# EAGLE design InputModule2 (EAGLE 6.3)
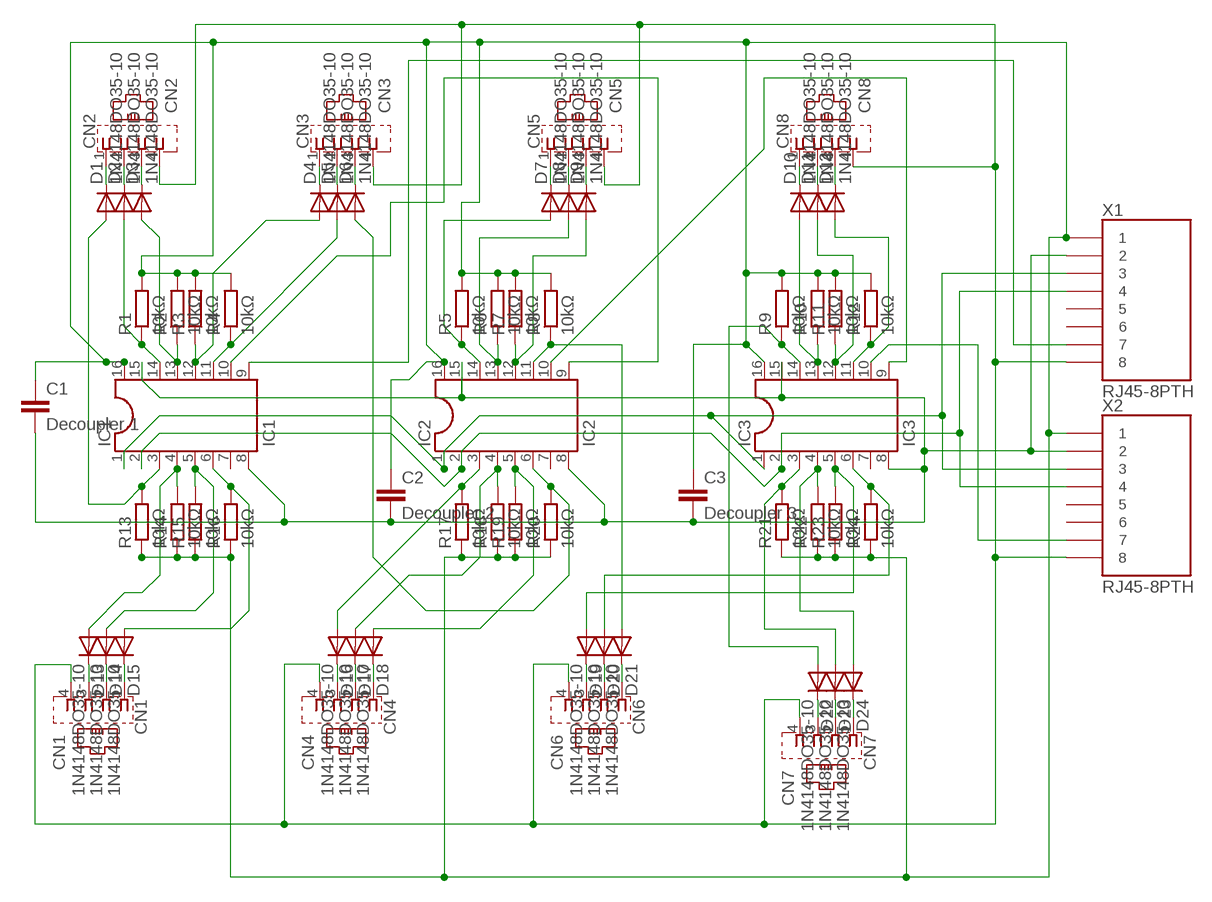
[diagram p0: schematic, sheet 1]

## Parts
C1  Decoupler 1  C5/2.5  [C5B2.5]
C2  Decoupler 2  C5/2.5  [C5B2.5]
C3  Decoupler 3  C5/2.5  [C5B2.5]
CN1  CN1  RJ11-6PC4  [RJ116PC4]
CN2  CN2  RJ11-6PC4  [RJ116PC4]
CN3  CN3  RJ11-6PC4  [RJ116PC4]
CN4  CN4  RJ11-6PC4  [RJ116PC4]
CN5  CN5  RJ11-6PC4  [RJ116PC4]
CN6  CN6  RJ11-6PC4  [RJ116PC4]
CN7  CN7  RJ11-6PC4  [RJ116PC4]
CN8  CN8  RJ11-6PC4  [RJ116PC4]
D1  1N4148DO35-10  [DO35-10]
D2  1N4148DO35-10  [DO35-10]
D3  1N4148DO35-10  [DO35-10]
D4  1N4148DO35-10  [DO35-10]
D5  1N4148DO35-10  [DO35-10]
D6  1N4148DO35-10  [DO35-10]
D7  1N4148DO35-10  [DO35-10]
D8  1N4148DO35-10  [DO35-10]
D9  1N4148DO35-10  [DO35-10]
D10  1N4148DO35-10  [DO35-10]
D11  1N4148DO35-10  [DO35-10]
D12  1N4148DO35-10  [DO35-10]
D13  1N4148DO35-10  [DO35-10]
D14  1N4148DO35-10  [DO35-10]
D15  1N4148DO35-10  [DO35-10]
D16  1N4148DO35-10  [DO35-10]
D17  1N4148DO35-10  [DO35-10]
D18  1N4148DO35-10  [DO35-10]
D19  1N4148DO35-10  [DO35-10]
D20  1N4148DO35-10  [DO35-10]
D21  1N4148DO35-10  [DO35-10]
D22  1N4148DO35-10  [DO35-10]
D23  1N4148DO35-10  [DO35-10]
D24  1N4148DO35-10  [DO35-10]
IC1  IC1  DIL16S  [SOCKET-16]
IC2  IC2  DIL16S  [SOCKET-16]
IC3  IC3  DIL16S  [SOCKET-16]
R1  10kΩ  R-EU_0207/10  [0207/10]
R2  10kΩ  R-EU_0207/10  [0207/10]
R3  10kΩ  R-EU_0207/10  [0207/10]
R4  10kΩ  R-EU_0207/10  [0207/10]
R5  10kΩ  R-EU_0207/10  [0207/10]
R6  10kΩ  R-EU_0207/10  [0207/10]
R7  10kΩ  R-EU_0207/10  [0207/10]
R8  10kΩ  R-EU_0207/10  [0207/10]
R9  10kΩ  R-EU_0207/10  [0207/10]
R10  10kΩ  R-EU_0207/10  [0207/10]
R11  10kΩ  R-EU_0207/10  [0207/10]
R12  10kΩ  R-EU_0207/10  [0207/10]
R13  10kΩ  R-EU_0207/10  [0207/10]
R14  10kΩ  R-EU_0207/10  [0207/10]
R15  10kΩ  R-EU_0207/10  [0207/10]
R16  10kΩ  R-EU_0207/10  [0207/10]
R17  10kΩ  R-EU_0207/10  [0207/10]
R18  10kΩ  R-EU_0207/10  [0207/10]
R19  10kΩ  R-EU_0207/10  [0207/10]
R20  10kΩ  R-EU_0207/10  [0207/10]
R21  10kΩ  R-EU_0207/10  [0207/10]
R22  10kΩ  R-EU_0207/10  [0207/10]
R23  10kΩ  R-EU_0207/10  [0207/10]
R24  10kΩ  R-EU_0207/10  [0207/10]
X1  RJ45-8PTH  [RJ45-8]
X2  RJ45-8PTH  [RJ45-8]

## Nets
3RD_DEBUG: CN1.4 CN2.4 CN3.4 CN4.4 CN5.4 CN6.4 CN7.4 CN8.4 X1.8 X2.8
GND: C1.2 C2.2 C3.2 IC1.8 IC1.15 IC2.8 IC2.15 IC3.8 IC3.15 X1.2 X2.2
N$1: CN8.2 D11.C
N$2: CN5.2 D8.C
N$3: CN8.1 D10.C
N$4: CN8.3 D12.C
N$5: CN7.1 D24.C
N$6: CN2.2 D2.C
N$7: CN3.1 D4.C
N$8: CN7.2 D23.C
N$9: CN1.3 D13.C
N$10: CN6.2 D20.C
N$11: CN7.3 D22.C
N$12: CN6.1 D21.C
N$13: CN2.1 D1.C
N$14: CN2.3 D3.C
N$15: CN3.2 D5.C
N$16: CN3.3 D6.C
N$17: CN5.1 D7.C
N$18: CN5.3 D9.C
N$19: CN6.3 D19.C
N$20: CN4.2 D17.C
N$21: CN4.1 D18.C
N$22: CN4.3 D16.C
N$23: CN1.2 D14.C
N$24: CN1.1 D15.C
N$25: D13.A IC1.4 R14.2
N$26: D1.A IC1.3 R13.2
N$27: D14.A IC1.5 R15.2
N$28: D12.A IC3.11 R12.1
N$29: D24.A IC3.4 R22.2
N$30: D20.A IC3.6 R24.2
N$31: D2.A IC1.14 R1.1
N$32: D3.A IC1.13 R2.1
N$33: D4.A IC1.12 R3.1
N$34: D5.A IC1.11 R4.1
N$35: D7.A IC2.14 R5.1
N$36: D8.A IC2.13 R6.1
N$37: D9.A IC2.12 R7.1
N$38: D21.A IC2.11 R8.1
N$39: D15.A IC1.6 R16.2
N$40: D10.A IC3.13 R10.1
N$41: D17.A IC2.4 R18.2
N$42: D16.A IC2.3 R17.2
N$43: D18.A IC2.5 R19.2
N$44: D6.A IC2.6 R20.2
N$45: D19.A IC3.5 R23.2
N$46: D23.A IC3.3 R21.2
N$47: D11.A IC3.12 R11.1
N$48: D22.A IC3.14 R9.1
N$50: IC1.1 IC2.1 IC3.1 X1.3 X2.3
N$52: IC1.2 IC2.2 IC3.2 X1.4 X2.4
N$56: IC1.10 IC2.9
N$57: IC2.10 IC3.9
N$58: IC1.9 X1.7
N$60: IC3.10 X2.7
VCC: C1.1 C2.1 C3.1 IC1.16 IC2.16 IC3.16 R1.2 R2.2 R3.2 R4.2 R5.2 R6.2 R7.2 R8.2 R9.2 R10.2 R11.2 R12.2 R13.1 R14.1 R15.1 R16.1 R17.1 R18.1 R19.1 R20.1 R21.1 R22.1 R23.1 R24.1 X1.1 X2.1
Unconnected: IC1.7 IC2.7 IC3.7 X1.5 X1.6 X2.5 X2.6

## Library data of the parts
C1-C3 = capacitor-wima:C: CAPACITOR naming: grid - package width
CN1-CN8 = RailLibrary:RJ11-6PC4
D1-D24 = diode:1N4148: DIODE high speed (Philips)
IC1-IC3 = ic-package:DIL16: Dual In Line / Socket
R1-R24 = resistor:R-EU_: RESISTOR, European symbol
X1 X2 = SparkFun-Connectors:RJ45-8: RJ45 Jack Simple RJ45, 8-pin connection - connector for common Cat5, Cat5e, and Cat6 Ethernet cables. Footprint not yet proven in production. Connector sku is PRT-00643; Breakout PCB sku is BOB-00716.

## Board
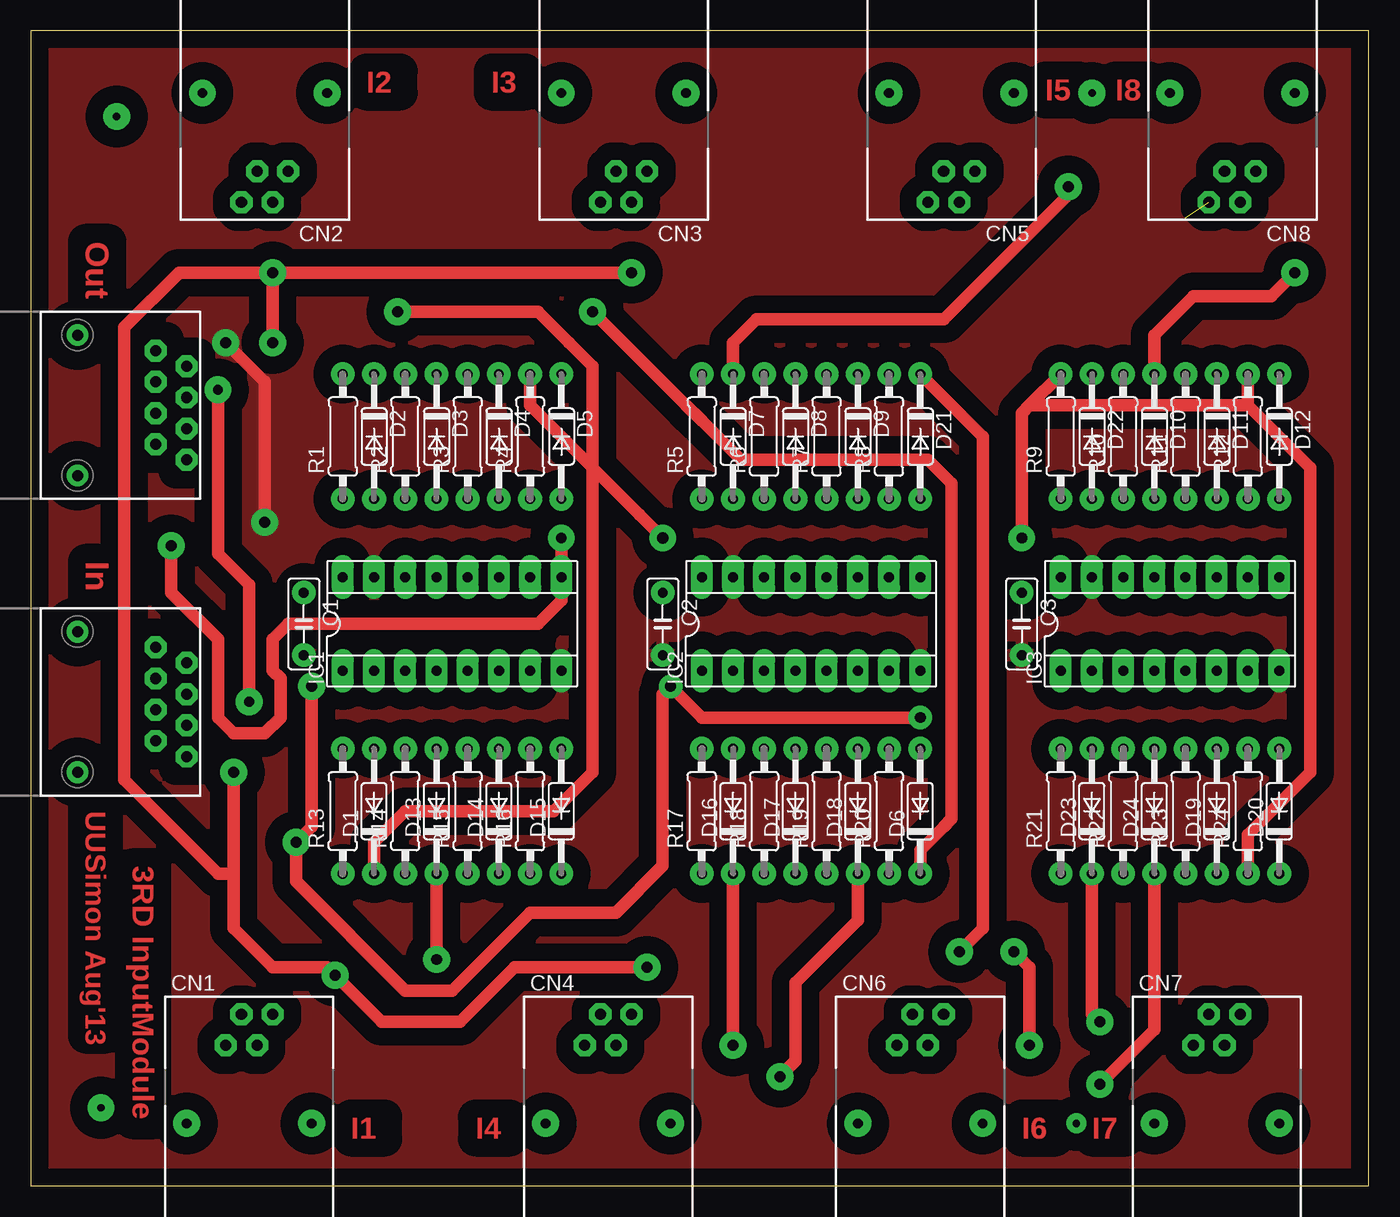
[diagram p1: board, top side]
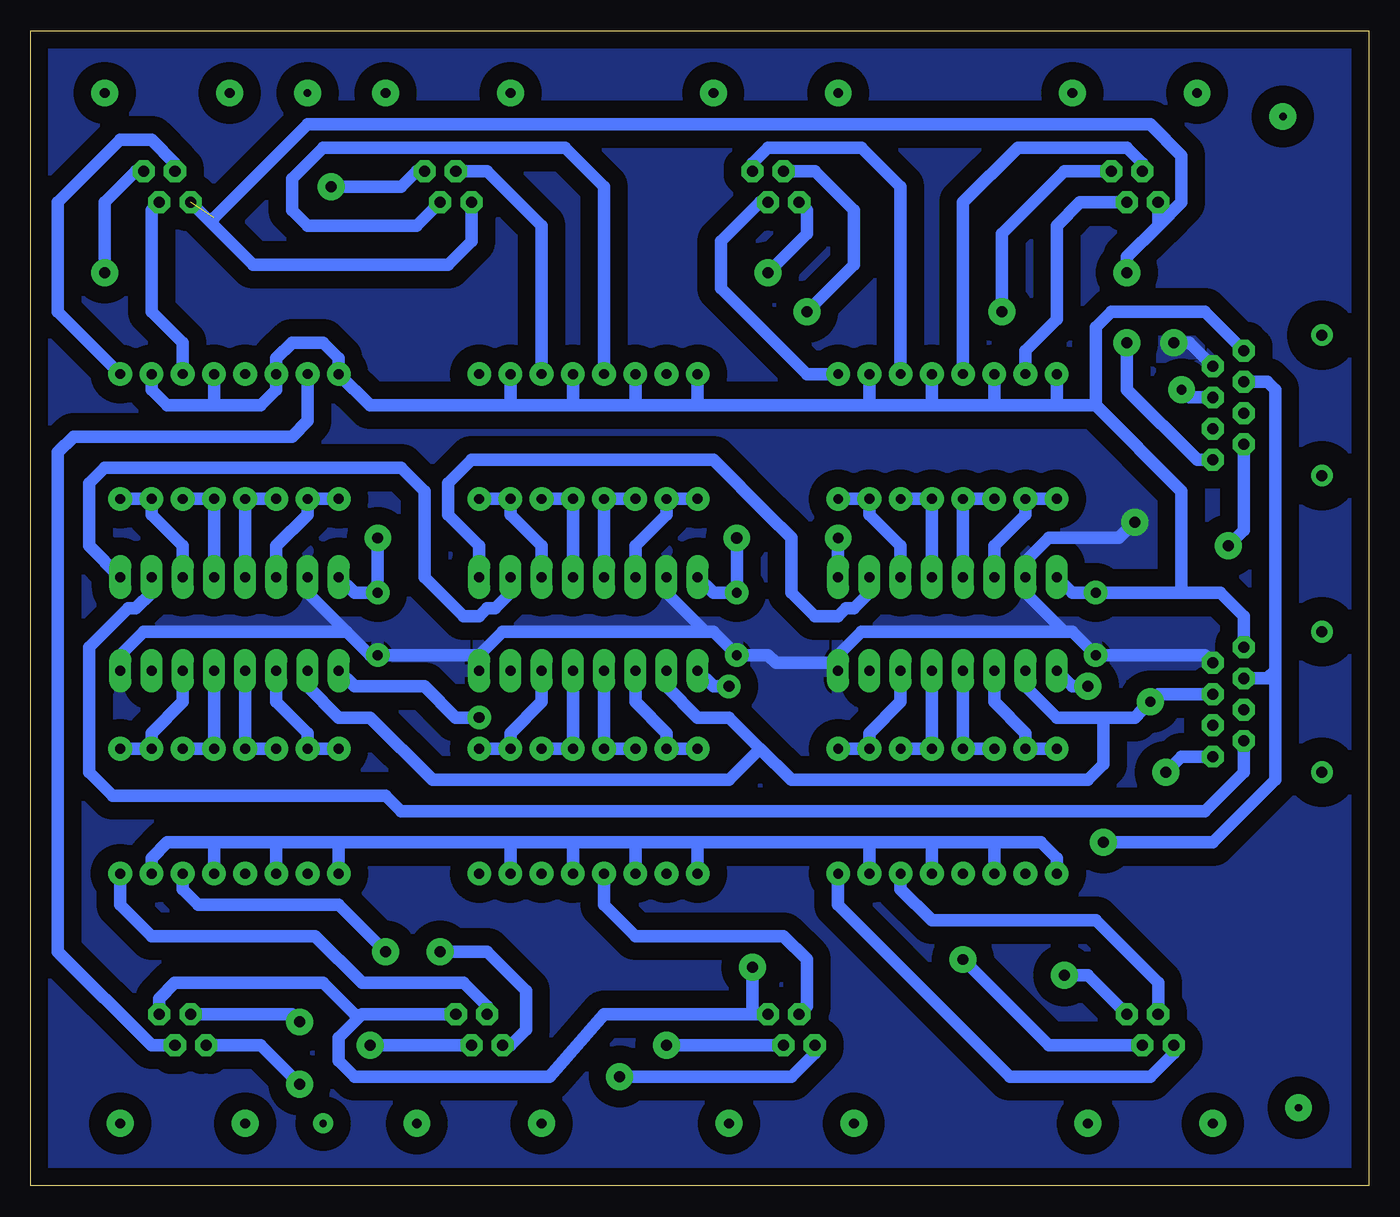
[diagram p2: board, bottom side, seen from below]

Size 108.89 x 93.97 mm. Coordinates in mm from the lower left corner, seen from the top.
Outline: 0,0 108.89,0 108.89,93.97 0,93.97 0,0
Copper layers (1*16): Top 0.035mm / dielectric 1.5mm / Bottom 0.035mm
Design rules "default *": minimum track width 0.6mm, minimum drill 35mil, track to track 1mm, track to pad 1mm, pad to pad 8mil, via to via 8mil, smd to smd 8mil, copper to edge 40mil, drill to drill 8mil, minimum pad ring 10mil, minimum via ring 20mil, stop-mask expansion 4mil, vias tented up to drill 0mil, thermal gap 10mil
Holes 0.6 mm at 88.9,117.48 111.12,-19.68 -0.64,-26.04

### Footprints (pad centres in the part's own frame; a part is rotated, then mirrored left to right if it is on the bottom)
C5B2.5 = drill 0.813 pad 1.93: 1 -2.54,0; 2 2.54,0
RJ116PC4 = drill 0.9 pad 1.803 octagon: 1 -1.905,5.08; 2 -0.635,7.62; 3 0.635,5.08; 4 1.905,7.62 | drill 0.8 pad 2.184: P$1 -5.08,-1.27; P$2 5.08,-1.27
DO35-10 = drill 0.8 pad 1.93: A 5.08,0; C -5.08,0
SOCKET-16 = drill 0.813 pad 1.778 long: 1 -8.89,-3.81; 2 -6.35,-3.81; 3 -3.81,-3.81; 4 -1.27,-3.81; 5 1.27,-3.81; 6 3.81,-3.81; 7 6.35,-3.81; 8 8.89,-3.81; 9 8.89,3.81; 10 6.35,3.81; 11 3.81,3.81; 12 1.27,3.81; 13 -1.27,3.81; 14 -3.81,3.81; 15 -6.35,3.81; 16 -8.89,3.81
0207/10 = drill 0.813 pad 1.93: 1 -5.08,0; 2 5.08,0
RJ45-8 = drill 0.9 pad 1.778 octagon: 1 -4.445,6.35; 2 -3.175,8.89; 3 -1.905,6.35; 4 -0.635,8.89; 5 0.635,6.35; 6 1.905,8.89; 7 3.175,6.35; 8 4.445,8.89 | drill 0.9 pad 1.778: P$1 -5.715,0; P$2 5.715,0

### Placement (x,y rotation side)
C1  22.23,45.72 270 top
C2  51.44,45.72 270 top
C3  80.64,45.72 270 top
CN1  17.78,6.35 0 top
CN2  19.05,87.63 180 top
CN3  48.26,87.63 180 top
CN4  46.99,6.35 0 top
CN5  74.93,87.63 180 top
CN6  72.39,6.35 0 top
CN7  96.52,6.35 0 top
CN8  97.79,87.63 180 top
D1  27.94,30.48 90 top
D2  27.94,60.96 270 top
D3  33.02,60.96 270 top
D4  38.1,60.96 270 top
D5  43.18,60.96 270 top
D6  72.39,30.48 90 top
D7  57.15,60.96 270 top
D8  62.23,60.96 270 top
D9  67.31,60.96 270 top
D10  91.44,60.96 270 top
D11  96.52,60.96 270 top
D12  101.6,60.96 270 top
D13  33.02,30.48 90 top
D14  38.1,30.48 90 top
D15  43.18,30.48 90 top
D16  57.15,30.48 90 top
D17  62.23,30.48 90 top
D18  67.31,30.48 90 top
D19  96.52,30.48 90 top
D20  101.6,30.48 90 top
D21  72.39,60.96 270 top
D22  86.36,60.96 270 top
D23  86.36,30.48 90 top
D24  91.44,30.48 90 top
IC1  34.29,45.72 0 top
IC2  63.5,45.72 0 top
IC3  92.71,45.72 0 top
R1  25.4,60.96 90 top
R2  30.48,60.96 90 top
R3  35.56,60.96 90 top
R4  40.64,60.96 90 top
R5  54.61,60.96 90 top
R6  59.69,60.96 90 top
R7  64.77,60.96 90 top
R8  69.85,60.96 90 top
R9  83.82,60.96 90 top
R10  88.9,60.96 90 top
R11  93.98,60.96 90 top
R12  99.06,60.96 90 top
R13  25.4,30.48 90 top
R14  30.48,30.48 90 top
R15  35.56,30.48 90 top
R16  40.64,30.48 90 top
R17  54.61,30.48 90 top
R18  59.69,30.48 90 top
R19  64.77,30.48 90 top
R20  69.85,30.48 90 top
R21  83.82,30.48 90 top
R22  88.9,30.48 90 top
R23  93.98,30.48 90 top
R24  99.06,30.48 90 top
X1  3.81,63.5 270 top
X2  3.81,39.37 270 top

### Tracks (layer width: path | path; a pad name or v marks a point on that pad's centre or on a via)
3RD_DEBUG  (via drill 0.89 pad 2.18, 0.9 pad 2.18)  (1 unrouted)
  Top 1.016: v48.9,74.3 v19.69,74.3 | v19.69,74.3 v19.69,68.58 | v50.16,17.78 39.37,17.78 34.92,13.34 28.58,13.34 v24.77,17.14 24.13,17.78 19.69,17.78 16.51,20.96 16.51,25.4 | 16.51,25.4 v16.51,33.66 | v19.69,74.3 12.06,74.3 7.62,69.85 7.62,33.02 15.24,25.4 16.51,25.4
  Bottom 0.6: 17.14,79.38 CN2.4 | 81.91,13.97 82.55,13.97
  Bottom 1.016: CN8.4 90.8,74.93 74.93,74.93 73.02,76.84 CN5.4 | 17.14,78.11 19.69,75.56 v19.69,74.3 | 17.14,78.11 17.14,79.38 | v19.69,68.58 19.69,64.77 13.97,59.05 X1.8 | v48.9,74.3 45.72,77.47 45.72,79.38 CN3.4 | CN6.4 81.91,13.97 83.82,12.07 83.82,10.16 82.55,8.89 66.67,8.89 62.23,13.97 50.16,13.97 | 82.55,13.97 85.09,16.51 97.16,16.51 98.42,15.24 CN7.4 | 50.16,13.97 v50.16,17.78 | v16.51,33.66 15.24,34.92 X2.8 | CN1.4 22.86,17.14 v24.77,17.14 | 50.16,13.97 CN4.4 | 17.14,78.11 15.24,80.01 15.24,83.82 17.78,86.36 86.36,86.36 93.98,78.74
GND  (via drill 0.89 pad 2.18)
  Top 1.016: v15.88,68.58 19.05,65.41 19.05,55.24 v19.05,53.97
  Bottom 0.61: 43.18,42.54 IC1.8 | IC2.8 72.39,43.18 | IC3.8 101.6,43.18 | 81.28,43.18 C3.2 | 27.94,48.26 IC1.15 | IC2.15 57.15,48.26 | IC3.15 86.36,48.26
  Bottom 1.016: 24.77,45.09 41.27,45.09 43.18,43.18 43.18,42.54 48.26,42.54 48.9,43.18 C2.2 53.34,45.09 53.98,45.09 | 53.98,45.09 70.48,45.09 72.39,43.18 C3.2 | 101.6,43.18 99.69,45.09 83.18,45.09 | 83.18,45.09 81.28,43.18 | 24.77,45.09 24.13,45.09 C1.2 13.34,43.18 X2.2 | 24.77,45.09 27.94,48.26 | 57.15,48.26 53.98,45.09 | 86.36,48.26 83.18,45.09 | v15.88,68.58 14.61,68.58 X1.2 | v19.05,53.97 20.32,52.7 26.03,52.7 27.94,50.8 IC1.15
  pour Bottom (isolate 1.422): 0,93.98 109.22,93.98 109.22,0 0,0
  pour Top (isolate 1.422): 0,93.98 109.22,93.98 109.22,0 0,0
N$1
  Bottom 1.016: D11.C 96.52,68.58 99.06,71.12 99.06,79.38 CN8.2
N$2
  Bottom 1.016: D8.C 62.23,81.28 65.41,84.45 85.09,84.45 87.63,81.92 87.63,79.38 86.36,78.11 77.47,78.11 CN5.2
N$3  (via drill 0.9 pad 2.18)
  Top 1.016: v102.87,74.3 100.96,72.39 94.61,72.39 91.44,69.22 D10.C
  Bottom 1.016: v102.87,74.3 102.87,80.01 100.33,82.55 CN8.1
N$4
  Bottom 1.016: D12.C 106.68,71.12 106.68,80.01 101.6,85.09 99.06,85.09 97.16,83.19 CN8.3
N$5  (via drill 0.89 pad 2.18)
  Top 1.016: v86.99,8.26 91.44,12.7 D24.C
  Bottom 0.6: 93.98,11.43 CN7.1
  Bottom 1.016: v86.99,8.26 90.17,11.43 93.98,11.43
N$6
  Bottom 1.016: CN2.2 23.49,80.01 25.4,78.11 25.4,70.48 27.94,67.95 D2.C
N$7
  Bottom 0.6: 50.16,83.19 CN3.1
  Bottom 1.016: 50.16,83.19 48.9,84.45 41.27,84.45 38.1,81.28 D4.C
N$8  (via drill 0.89 pad 2.18)
  Top 1.016: v86.99,13.34 86.36,13.97 D23.C
  Bottom 1.016: v86.99,13.34 87.63,13.97 CN7.2
N$9  (via drill 0.89 pad 2.18)
  Top 1.016: D13.C v33.02,18.41
  Bottom 1.016: v33.02,18.41 26.03,11.43 CN1.3
N$10
  Bottom 1.016: D20.C 101.6,22.86 99.06,20.32 85.72,20.32 81.91,16.51 73.66,16.51 71.75,14.61 CN6.2
N$11
  Bottom 1.016: CN7.3 99.06,11.43 106.68,19.05 106.68,59.69 105.41,60.96 87.63,60.96 86.36,62.23 D22.C
N$12  (via drill 0.89 pad 2.18)
  Top 1.016: v75.56,19.05 77.47,20.96 77.47,60.96 D21.C
  Bottom 0.6: 69.85,11.43 CN6.1
  Bottom 1.016: 69.85,11.43 68.58,12.7 68.58,15.88 71.75,19.05 v75.56,19.05
N$13  (via drill 0.89 pad 2.18)
  Top 1.016: v29.84,71.12 39.37,71.12 41.27,71.12 43.82,68.58 45.72,66.67 45.72,33.66 42.55,30.48 30.48,30.48 27.94,27.94 27.94,26.67 D1.C
  Bottom 1.016: CN2.1 24.77,82.55 29.84,77.47 v29.84,71.12
N$14
  Bottom 1.016: D3.C 33.02,80.01 28.58,84.45 19.69,84.45 18.41,83.19 CN2.3
N$15
  Bottom 1.016: D5.C 45.72,66.04 52.7,73.03 52.7,76.84 49.53,80.01 CN3.2
N$16  (via drill 0.89 pad 2.18)
  Top 1.016: v45.72,71.12 53.34,63.5 54.61,62.23 57.79,59.05 73.02,59.05 74.93,57.15 74.93,29.85 74.29,29.21 72.39,27.3 D6.C
  Bottom 1.016: CN3.3 45.09,82.55 41.91,79.38 41.91,74.93 v45.72,71.12
N$17  (via drill 0.89 pad 2.18)
  Top 1.016: v84.45,81.28 84.45,80.65 74.29,70.48 59.05,70.48 57.15,68.58 D7.C
  Bottom 0.6: 77.47,82.55 CN5.1
  Bottom 1.016: v84.45,81.28 78.74,81.28 77.47,82.55
N$18
  Bottom 0.6: 73.66,82.55 CN5.3
  Bottom 1.016: 73.66,82.55 71.75,82.55 67.31,78.11 D9.C
N$19  (via drill 0.89 pad 2.18)
  Top 1.016: v81.28,11.43 81.28,17.78 v80.01,19.05
  Bottom 1.016: v81.28,11.43 CN6.3 | v80.01,19.05 83.82,22.86 95.25,22.86 96.52,24.13 D19.C
N$20
  Bottom 1.016: D17.C 62.23,22.86 59.69,20.32 47.62,20.32 45.72,18.41 45.72,14.61 CN4.2
N$21  (via drill 0.89 pad 2.18)
  Top 1.016: v60.96,8.89 62.23,10.16 62.23,16.51 67.31,21.59 D18.C
  Bottom 1.016: v60.96,8.89 46.99,8.89 45.09,10.79 CN4.1
N$22  (via drill 0.89 pad 2.18)
  Top 1.016: D16.C v57.15,11.43
  Bottom 1.016: v57.15,11.43 CN4.3
N$23
  Bottom 1.016: D14.C 38.1,24.13 35.56,21.59 22.23,21.59 17.14,16.51 CN1.2
N$24
  Bottom 1.016: D15.C 43.18,22.86 29.21,8.89 17.78,8.89 15.88,10.79 CN1.1
N$25
  Bottom 1.016: IC1.4 D13.A R14.2
N$26
  Bottom 1.016: IC1.3 30.48,39.37 27.94,36.83 D1.A R13.2
N$27
  Bottom 1.016: IC1.5 R15.2 D14.A
N$28
  Bottom 0.6: 96.52,50.8 IC3.11
  Bottom 1.016: 96.52,50.8 96.52,52.07 99.06,54.61 R12.1 D12.A
N$29
  Bottom 1.016: IC3.4 D24.A R22.2
N$30
  Bottom 1.016: IC3.6 96.52,39.37 99.06,36.83 R24.2 D20.A
N$31
  Bottom 1.016: IC1.14 30.48,52.07 27.94,54.61 D2.A R1.1
N$32
  Bottom 1.016: IC1.13 D3.A R2.1
N$33
  Bottom 1.016: IC1.12 R3.1 D4.A
N$34
  Bottom 1.016: IC1.11 38.1,52.07 40.64,54.61 R4.1 D5.A
N$35
  Bottom 1.016: IC2.14 59.69,52.07 57.15,54.61 D7.A R5.1
N$36
  Bottom 1.016: IC2.13 D8.A R6.1
N$37
  Bottom 1.016: IC2.12 R7.1 D9.A
N$38
  Bottom 0.6: 67.31,50.8 IC2.11
  Bottom 1.016: 67.31,50.8 67.31,52.07 69.85,54.61 R8.1 D21.A
N$39
  Bottom 0.6: 38.1,40.64 IC1.6
  Bottom 1.016: 38.1,40.64 38.1,39.37 40.64,36.83 R16.2 D15.A
N$40
  Bottom 1.016: IC3.13 D10.A R10.1
N$41
  Bottom 1.016: IC2.4 D17.A R18.2
N$42
  Bottom 1.016: IC2.3 59.69,39.37 57.15,36.83 D16.A R17.2
N$43
  Bottom 1.016: IC2.5 R19.2 D18.A
N$44
  Bottom 1.016: IC2.6 67.31,39.37 69.85,36.83 R20.2 D6.A
N$45
  Bottom 1.016: IC3.5 R23.2 D19.A
N$46
  Bottom 1.016: IC3.3 88.9,39.37 86.36,36.83 D23.A R21.2
N$47
  Bottom 1.016: IC3.12 R11.1 D11.A
N$48
  Bottom 1.016: IC3.14 88.9,52.07 86.36,54.61 D22.A R9.1
N$49  (via drill 0.6 pad 2.18)
  other vias: 6.98,87
N$50  (via drill 0.89, 0.89 pad 2.18)
  Top 1.016: v22.86,40.64 22.86,29.21 v21.59,27.94 21.59,24.77 30.48,15.88 34.29,15.88 40.64,22.23 47.62,22.23 51.44,26.04 51.44,40 v52.07,40.64 54.61,38.1 v72.39,38.1
  Bottom 1.016: X1.3 8.25,65.41 7.62,64.77 7.62,41.91 | 7.62,41.91 8.25,41.27 X2.3 | IC1.1 24.13,40.64 v22.86,40.64 | v21.59,27.94 12.7,27.94 7.62,33.02 7.62,41.91 | IC2.1 53.34,40.64 v52.07,40.64 | IC3.1 82.55,40.64 76.83,40.64 74.29,38.1 v72.39,38.1
N$51  (via drill 0.6 pad 2.18)
  other vias: 86.36,88.9
N$52  (via drill 0.8 pad 2.18)
  Top 1.016: v17.78,39.37 17.78,48.89 15.24,51.43 v15.24,64.77
  Bottom 0.6: 27.94,40.64 IC1.2 | 57.15,40.64 IC2.2
  Bottom 1.016: X2.4 17.14,40 v17.78,39.37 18.41,38.73 19.05,38.1 21.59,38.1 | X1.4 14.61,64.14 v15.24,64.77 | 27.94,40.64 25.4,38.1 21.59,38.1 | 57.15,40.64 54.61,38.1 52.07,38.1 49.53,35.56 | 49.53,35.56 46.99,33.02 22.86,33.02 21.59,34.29 21.59,38.1 | IC3.2 86.36,40.64 83.82,38.1 81.28,38.1 76.2,33.02 52.07,33.02 49.53,35.56
N$53
  pour Bottom (isolate 1.422): 0,93.98 109.22,93.98 109.22,0 0,0
N$54
  pour Top (isolate 1.422): 0,93.98 109.22,93.98 109.22,0 0,0
N$55  (via drill 0.6 pad 2.18)
  other vias: 5.71,6.35
N$56
  Bottom 0.6: IC2.9 72.39,50.8
  Bottom 1.016: IC1.10 40.64,48.26 41.91,46.99 42.55,46.99 43.18,46.35 45.09,46.35 46.99,48.26 46.99,52.7 48.9,54.61 53.34,59.05 73.02,59.05 74.93,57.15 74.93,54.61 72.39,52.07 72.39,50.8
N$57
  Bottom 0.6: 69.85,48.26 IC2.10
  Bottom 1.016: 69.85,48.26 71.12,46.99 71.75,46.99 72.39,46.35 73.66,46.35 76.83,49.53 76.83,56.52 78.74,58.42 102.87,58.42 104.14,57.15 104.14,52.07 IC3.9
N$58  (via drill 0.89 pad 2.18)
  Top 1.016: v43.18,52.7 43.18,47.62 41.27,45.72 20.95,45.72 19.69,44.45 19.69,41.91 20.32,41.27 20.32,38.1 19.05,36.83 16.51,36.83 15.24,38.1 15.24,38.73 15.24,44.45 11.43,48.26 v11.43,52.07
  Bottom 1.016: v43.18,52.7 IC1.9 | v11.43,52.07 10.16,53.34 X1.7
N$60
  Bottom 0.6: 99.06,48.26 IC3.10
  Bottom 1.016: 99.06,48.26 100.33,46.99 100.96,46.99 104.14,43.81 104.14,33.66 102.23,31.75 80.01,31.75 78.74,30.48 13.34,30.48 10.16,33.66 X2.7
N$61  (via drill 0.6)
  other vias: 85.09,5.08
VCC  (via drill 0.89 pad 2.18, 0.9 pad 2.18)
  Top 1.016: v80.64,52.7 80.64,62.86 81.28,63.5 | 81.28,63.5 R9.2 | R24.1 99.06,26.67 99.06,28.57 104.14,33.66 104.14,58.42 99.06,63.5 | 99.06,63.5 R12.2 | 99.06,63.5 81.28,63.5 | v51.44,52.7 49.53,54.61 40.64,63.5 R4.2
  Bottom 1.016: IC1.16 24.13,48.26 C1.1 20.32,48.26 17.14,48.26 15.24,48.26 | X1.1 13.34,71.12 20.95,71.12 22.23,69.85 22.23,63.5 | R13.1 25.4,26.67 26.67,27.94 30.48,27.94 | 35.56,27.94 R15.1 | 40.64,27.94 35.56,27.94 | 30.48,27.94 R14.1 | 35.56,27.94 30.48,27.94 | 88.9,27.94 83.82,27.94 | R22.1 88.9,27.94 | 93.98,27.94 R23.1 | 88.9,27.94 93.98,27.94 | R24.1 99.06,26.67 97.79,27.94 93.98,27.94 | 59.69,27.94 54.61,27.94 | R18.1 59.69,27.94 | 59.69,27.94 64.77,27.94 | 64.77,27.94 69.85,27.94 | R19.1 64.77,27.94 | 83.82,27.94 R21.1 | 69.85,27.94 83.82,27.94 | R20.1 69.85,27.94 | 40.64,27.94 R16.1 | 40.64,27.94 48.26,27.94 54.61,27.94 | R17.1 54.61,27.94 | X2.1 10.16,46.35 12.06,48.26 15.24,48.26 | 30.48,63.5 R2.2 | 22.23,63.5 25.4,63.5 | 25.4,63.5 30.48,63.5 | 35.56,63.5 R3.2 | 30.48,63.5 35.56,63.5 | 40.64,63.5 R4.2 | 35.56,63.5 40.64,63.5 | 15.24,48.26 15.24,56.52 22.23,63.5 | 93.98,63.5 R11.2 | 93.98,63.5 90.17,63.5 88.9,64.77 R10.2 88.9,67.31 87.63,68.58 85.09,68.58 83.82,67.31 R9.2 81.28,63.5 80.64,63.5 69.85,63.5 | R12.2 99.06,64.77 97.79,63.5 93.98,63.5 | IC3.16 82.55,48.26 C3.1 v80.64,52.7 | 64.77,63.5 R7.2 | 69.85,63.5 64.77,63.5 | R8.2 69.85,63.5 | 54.61,63.5 R5.2 | R6.2 59.69,63.5 | IC2.16 53.34,48.26 C2.1 v51.44,52.7 | 50.8,63.5 51.44,63.5 | 50.8,63.5 51.44,63.5 | 51.44,63.5 54.61,63.5 | 54.61,63.5 59.69,63.5 | 59.69,63.5 64.77,63.5 | 50.8,63.5 40.64,63.5 | 25.4,63.5 R1.2

### Text on the board
Top: I2 | I3 | I5 | I8 | Out | In | UUSimon Aug'13 | 3RD InputModule | I1 | I4 | I6 | I7